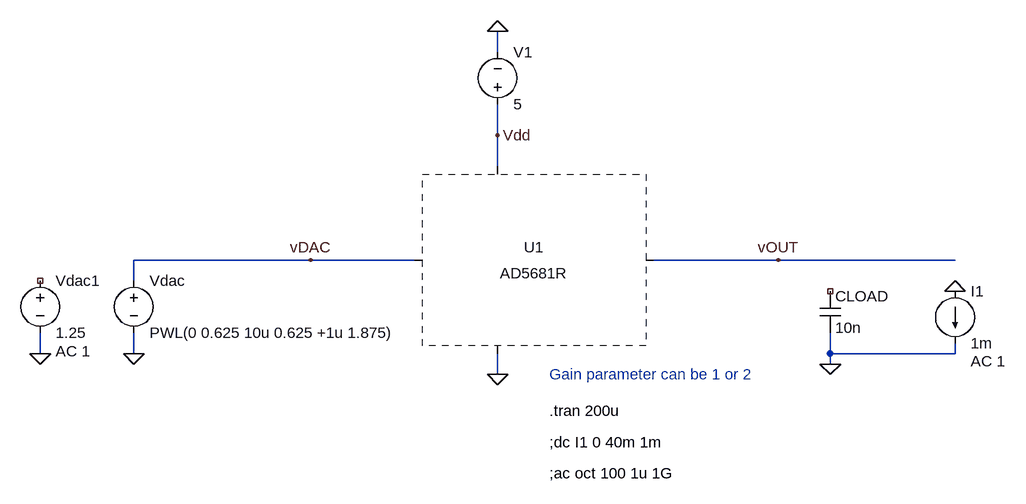
[diagram p0: schematic AD5681R.asc]
AD5681R.asc, the LTspice schematic file:
Version 4
SHEET 1 952 680
WIRE -240 -208 -240 -240
WIRE -240 -80 -240 -128
WIRE -240 -32 -240 -80
WIRE -528 112 -800 112
WIRE -368 112 -528 112
WIRE 192 112 0 112
WIRE 464 112 192 112
WIRE -800 144 -800 112
WIRE -944 256 -944 224
WIRE -800 256 -800 224
WIRE 272 256 272 224
WIRE 464 256 464 240
WIRE 464 256 272 256
WIRE 272 272 272 256
WIRE -240 288 -240 256
FLAG 192 112 vOUT
FLAG -800 256 0
FLAG -528 112 vDAC
FLAG -240 -240 0
FLAG -240 288 0
FLAG 272 272 0
FLAG -240 -80 Vdd
FLAG 464 160 0
FLAG -944 256 0
SYMBOL cap 256 160 R0
SYMATTR InstName CLOAD
SYMATTR Value 10n
SYMBOL voltage -800 128 R0
WINDOW 123 24 124 Left 2
WINDOW 39 0 0 Left 0
SYMATTR InstName Vdac
SYMATTR Value PWL(0 0.625 10u 0.625 +1u 1.875)
SYMBOL voltage -240 -112 M180
WINDOW 0 24 96 Left 2
WINDOW 3 24 16 Left 2
WINDOW 123 0 0 Left 0
WINDOW 39 0 0 Left 0
SYMATTR InstName V1
SYMATTR Value 5
SYMBOL current 464 160 R0
WINDOW 123 24 108 Left 2
WINDOW 39 0 0 Left 0
SYMATTR Value2 AC 1
SYMATTR InstName I1
SYMATTR Value 1m
SYMBOL AD5681R -208 112 R0
SYMATTR InstName U1
SYMBOL voltage -944 128 R0
WINDOW 123 24 124 Left 2
WINDOW 39 0 0 Left 0
SYMATTR Value2 AC 1
SYMATTR InstName Vdac1
SYMATTR Value 1.25
TEXT -160 344 Left 2 !.tran 200u
TEXT -160 392 Left 2 !;dc I1 0 40m 1m
TEXT -160 440 Left 2 !;ac oct 100 1u 1G
TEXT -160 288 Left 2 ;Gain parameter can be 1 or 2

The netlist it stands for:
* AD5681R.asc
CLOAD NC_01 0 10n
Vdac vDAC 0 PWL(0 0.625 10u 0.625 +1u 1.875)
V1 Vdd 0 5
I1 0 0 1m AC 1
* U1: AD5681R (symbol AD5681R not available, pin order unknown); nets seen at it: 0, vDAC, Vdd, vOUT
Vdac1 NC_02 0 1.25 AC 1
.tran 200u
;dc I1 0 40m 1m
;ac oct 100 1u 1G
* Gain parameter can be 1 or 2
.backanno
.end